# EAGLE schematic RUDAS_KID_designBox (EAGLE 9.3.0)

## Sheet 1 of 2
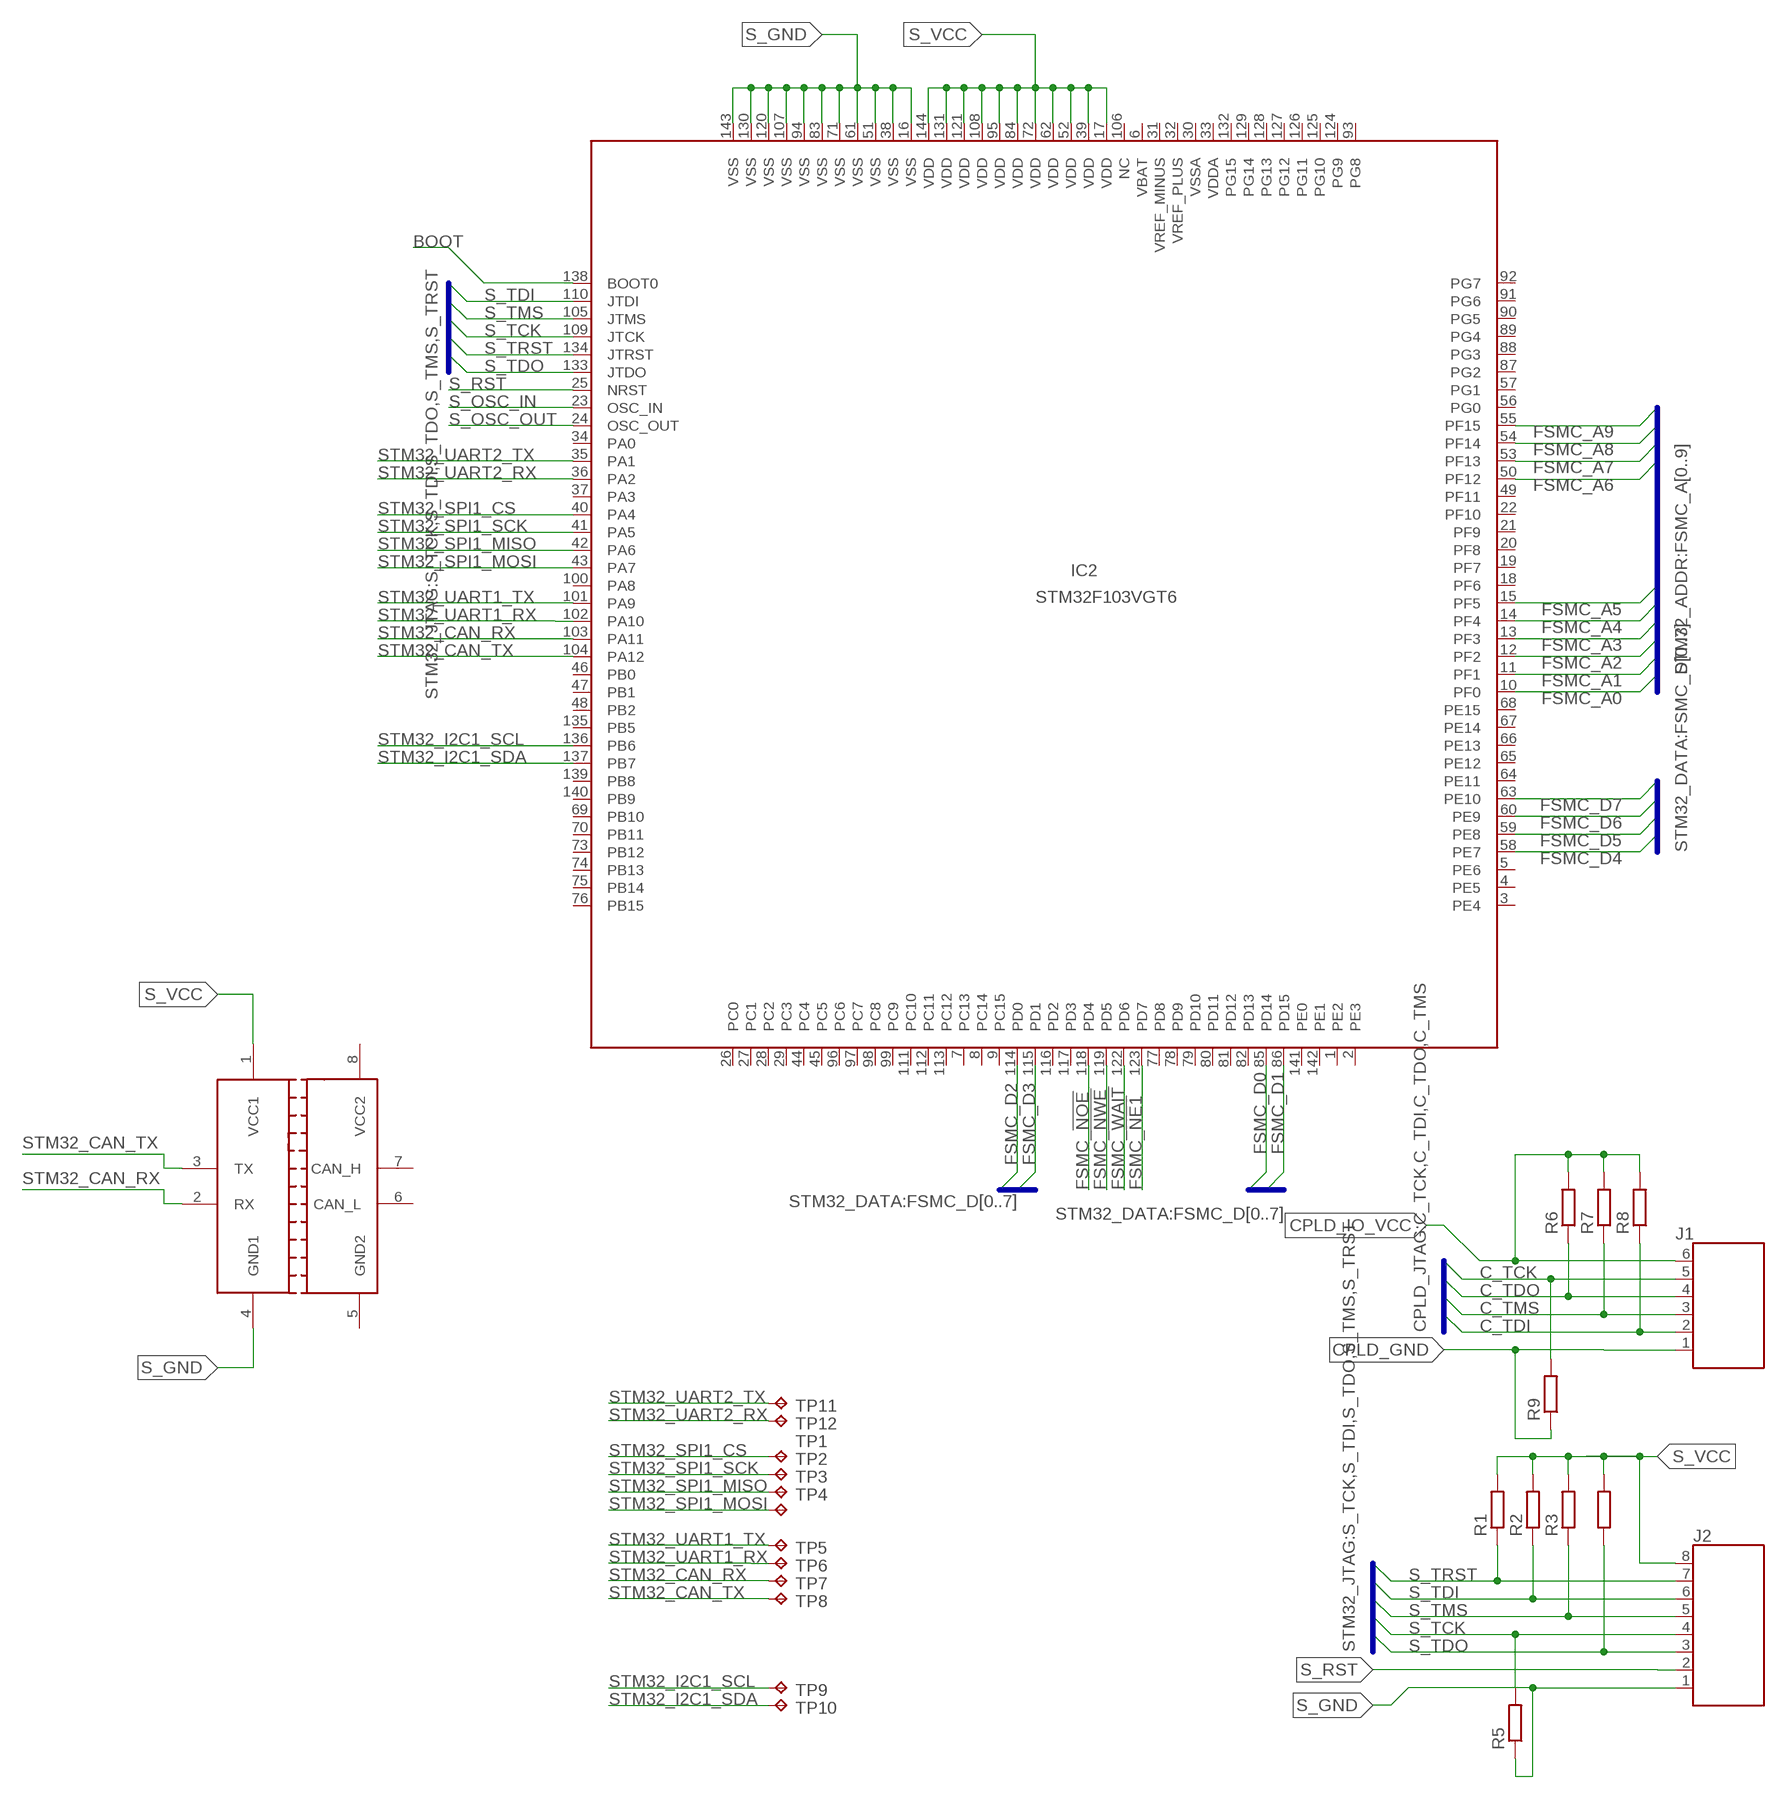
[diagram p0: schematic, sheet 1, part 1 of 2]
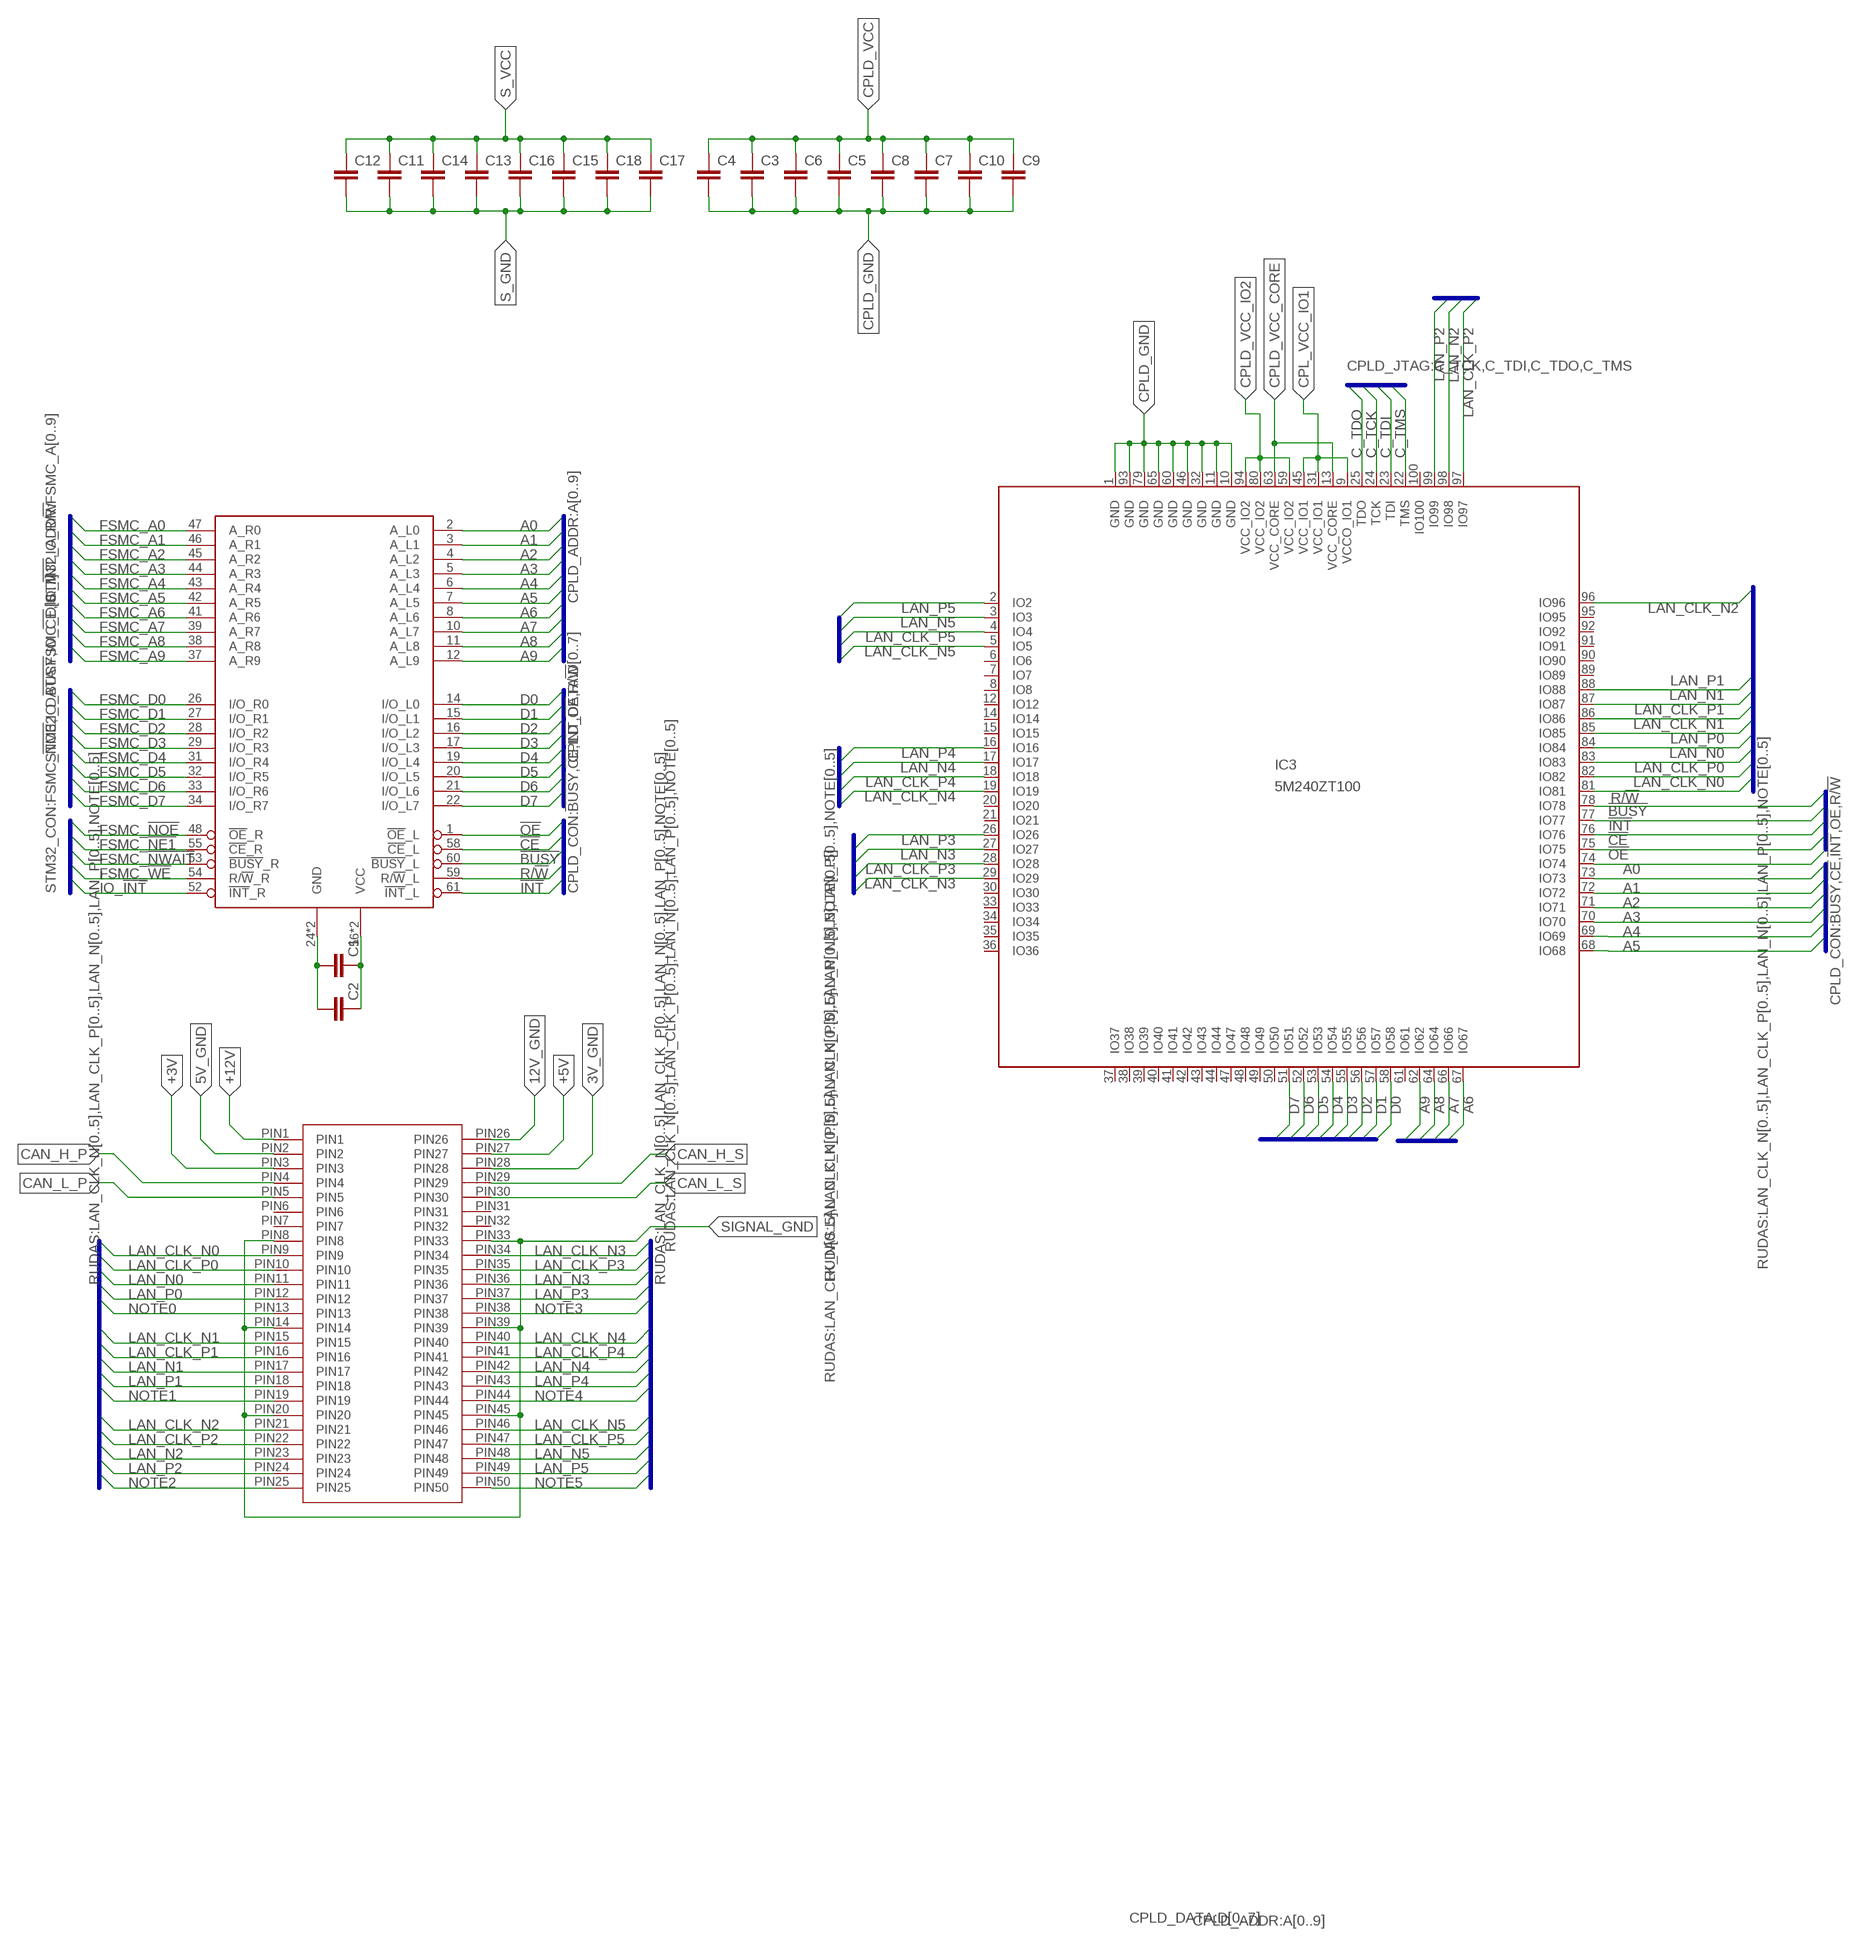
[diagram p1: schematic, sheet 1, part 2 of 2]

### Parts
C1  C-EUC2012  [C2012]
C2  C-EUC2012  [C2012]
C3  C-EUC2012  [C2012]
C4  C-EUC2012  [C2012]
C5  C-EUC2012  [C2012]
C6  C-EUC2012  [C2012]
C7  C-EUC2012  [C2012]
C8  C-EUC2012  [C2012]
C9  C-EUC2012  [C2012]
C10  C-EUC2012  [C2012]
C11  C-EUC2012  [C2012]
C12  C-EUC2012  [C2012]
C13  C-EUC2012  [C2012]
C14  C-EUC2012  [C2012]
C15  C-EUC2012  [C2012]
C16  C-EUC2012  [C2012]
C17  C-EUC2012  [C2012]
C18  C-EUC2012  [C2012]
IC2  STM32F103VGT6  STM32F1_XL_DENSITY_LQFP144  [LQFP144]
IC3  5M240ZT100  [TQFP100]
J1  686106183522  [686106183522]
J2  686108183422  [686108183422]
R1  R-EU_R2012  [R2012]
R2  R-EU_R2012  [R2012]
R3  R-EU_R2012  [R2012]
R4  R-EU_R2012  [R2012]
R5  R-EU_R2012  [R2012]
R6  R-EU_R2012  [R2012]
R7  R-EU_R2012  [R2012]
R8  R-EU_R2012  [R2012]
R9  R-EU_R2012  [R2012]
TP1  TP063  [TP_063]
TP2  TP063  [TP_063]
TP3  TP063  [TP_063]
TP4  TP063  [TP_063]
TP5  TP063  [TP_063]
TP6  TP063  [TP_063]
TP7  TP063  [TP_063]
TP8  TP063  [TP_063]
TP9  TP063  [TP_063]
TP10  TP063  [TP_063]
TP11  TP063  [TP_063]
TP12  TP063  [TP_063]
U$1  IDT71V30  [TQFP64]
U$2  ISO1050  [SOP8]
U$5  CARD_EDGE_50PINM80-5305042  [M80-5305042]

### Nets
3V_GND: U$5.PIN28
5V_GND: U$5.PIN2
12V_GND: U$5.PIN26
!BUSY!: IC3.77(IO77) U$1.60(!BUSY!_L)
!CE!: IC3.75(IO75) U$1.58(!CE!_L)
!INT!: IC3.76(IO76) U$1.61(!INT!_L)
!OE!: IC3.74(IO74) U$1.1(!OE!_L)
+3V: U$5.PIN3
+5V: U$5.PIN27
+12V: U$5.PIN1
A0: IC3.73(IO73) U$1.2(A_L0)
A1: IC3.72(IO72) U$1.3(A_L1)
A2: IC3.71(IO71) U$1.4(A_L2)
A3: IC3.70(IO70) U$1.5(A_L3)
A4: IC3.69(IO69) U$1.6(A_L4)
A5: IC3.68(IO68) U$1.7(A_L5)
A6: IC3.67(IO67) U$1.8(A_L6)
A7: IC3.66(IO66) U$1.10(A_L7)
A8: IC3.64(IO64) U$1.11(A_L8)
A9: IC3.62(IO62) U$1.12(A_L9)
BOOT: IC2.138(BOOT0)
C_TCK: IC3.24(TCK) J1.5 R9.2
C_TDI: IC3.23(TDI) J1.2 R8.1
C_TDO: IC3.25(TDO) J1.4 R6.1
C_TMS: IC3.22(TMS) J1.3 R7.1
CAN_H_P: U$5.PIN4
CAN_H_S: U$5.PIN29
CAN_L_P: U$5.PIN5
CAN_L_S: U$5.PIN30
CPL_VCC_IO1: IC3.9(VCCO_IO1) IC3.31(VCC_IO1) IC3.45(VCC_IO1)
CPLD_GND: C3.2 C4.2 C5.2 C6.2 C7.2 C8.2 C9.2 C10.2 IC3.1(GND) IC3.10(GND) IC3.11(GND) IC3.32(GND) IC3.46(GND) IC3.60(GND) IC3.65(GND) IC3.79(GND) IC3.93(GND) J1.1 R9.1
CPLD_IO_VCC: J1.6 R6.2 R7.2 R8.2
CPLD_VCC: C3.1 C4.1 C5.1 C6.1 C7.1 C8.1 C9.1 C10.1
CPLD_VCC_CORE: IC3.13(VCC_CORE) IC3.63(VCC_CORE)
CPLD_VCC_IO2: IC3.59(VCC_IO2) IC3.80(VCC_IO2) IC3.94(VCC_IO2)
D0: IC3.58(IO58) U$1.14(I/O_L0)
D1: IC3.57(IO57) U$1.15(I/O_L1)
D2: IC3.56(IO56) U$1.16(I/O_L2)
D3: IC3.55(IO55) U$1.17(I/O_L3)
D4: IC3.54(IO54) U$1.19(I/O_L4)
D5: IC3.53(IO53) U$1.20(I/O_L5)
D6: IC3.52(IO52) U$1.21(I/O_L6)
D7: IC3.51(IO51) U$1.22(I/O_L7)
FSMC_!NE1!: IC2.123(PD7) U$1.55(!CE!_R)
FSMC_!NOE!: IC2.118(PD4) U$1.48(!OE!_R)
FSMC_!NWAIT!: U$1.53(!BUSY!_R)
FSMC_!NWE!: IC2.119(PD5)
FSMC_!WAIT!: IC2.122(PD6)
FSMC_!WE!: U$1.54(R/!W!_R)
FSMC_A0: IC2.10(PF0) U$1.47(A_R0)
FSMC_A1: IC2.11(PF1) U$1.46(A_R1)
FSMC_A2: IC2.12(PF2) U$1.45(A_R2)
FSMC_A3: IC2.13(PF3) U$1.44(A_R3)
FSMC_A4: IC2.14(PF4) U$1.43(A_R4)
FSMC_A5: IC2.15(PF5) U$1.42(A_R5)
FSMC_A6: IC2.50(PF12) U$1.41(A_R6)
FSMC_A7: IC2.53(PF13) U$1.39(A_R7)
FSMC_A8: IC2.54(PF14) U$1.38(A_R8)
FSMC_A9: IC2.55(PF15) U$1.37(A_R9)
FSMC_D0: IC2.85(PD14) U$1.26(I/O_R0)
FSMC_D1: IC2.86(PD15) U$1.27(I/O_R1)
FSMC_D2: IC2.114(PD0) U$1.28(I/O_R2)
FSMC_D3: IC2.115(PD1) U$1.29(I/O_R3)
FSMC_D4: IC2.58(PE7) U$1.31(I/O_R4)
FSMC_D5: IC2.59(PE8) U$1.32(I/O_R5)
FSMC_D6: IC2.60(PE9) U$1.33(I/O_R6)
FSMC_D7: IC2.63(PE10) U$1.34(I/O_R7)
IO_!INT!: U$1.52(!INT!_R)
LAN_CLK_N0: IC3.81(IO81) U$5.PIN9
LAN_CLK_N1: IC3.85(IO85) U$5.PIN15
LAN_CLK_N2: IC3.96(IO96) U$5.PIN21
LAN_CLK_N3: IC3.29(IO29) U$5.PIN34
LAN_CLK_N4: IC3.19(IO19) U$5.PIN40
LAN_CLK_N5: IC3.5(IO5) U$5.PIN46
LAN_CLK_P0: IC3.82(IO82) U$5.PIN10
LAN_CLK_P1: IC3.86(IO86) U$5.PIN16
LAN_CLK_P2: IC3.97(IO97) U$5.PIN22
LAN_CLK_P3: IC3.28(IO28) U$5.PIN35
LAN_CLK_P4: IC3.18(IO18) U$5.PIN41
LAN_CLK_P5: IC3.4(IO4) U$5.PIN47
LAN_N0: IC3.83(IO83) U$5.PIN11
LAN_N1: IC3.87(IO87) U$5.PIN17
LAN_N2: IC3.98(IO98) U$5.PIN23
LAN_N3: IC3.27(IO27) U$5.PIN36
LAN_N4: IC3.17(IO17) U$5.PIN42
LAN_N5: IC3.3(IO3) U$5.PIN48
LAN_P0: IC3.84(IO84) U$5.PIN12
LAN_P1: IC3.88(IO88) U$5.PIN18
LAN_P2: IC3.99(IO99) U$5.PIN24
LAN_P3: IC3.26(IO26) U$5.PIN37
LAN_P4: IC3.16(IO16) U$5.PIN43
LAN_P5: IC3.2(IO2) U$5.PIN49
N$1: C1.1 C2.1 U$1.56(VCC) U$1.57(VCC)
N$2: C1.2 C2.2 U$1.24(GND) U$1.25(GND)
NOTE0: U$5.PIN13
NOTE1: U$5.PIN19
NOTE2: U$5.PIN25
NOTE3: U$5.PIN38
NOTE4: U$5.PIN44
NOTE5: U$5.PIN50
R/!W!: IC3.78(IO78) U$1.59(R/!W!_L)
S_GND: C11.2 C12.2 C13.2 C14.2 C15.2 C16.2 C17.2 C18.2 IC2.16(VSS) IC2.38(VSS) IC2.51(VSS) IC2.61(VSS) IC2.71(VSS) IC2.83(VSS) IC2.94(VSS) IC2.107(VSS) IC2.120(VSS) IC2.130(VSS) IC2.143(VSS) J2.1 R5.1 U$2.4(GND1)
S_OSC_IN: IC2.23(OSC_IN)
S_OSC_OUT: IC2.24(OSC_OUT)
S_RST: IC2.25(NRST) J2.2
S_TCK: IC2.109(JTCK) J2.4 R5.2
S_TDI: IC2.110(JTDI) J2.6 R2.1
S_TDO: IC2.133(JTDO) J2.3 R4.1
S_TMS: IC2.105(JTMS) J2.5 R3.1
S_TRST: IC2.134(JTRST) J2.7 R1.1
S_VCC: C11.1 C12.1 C13.1 C14.1 C15.1 C16.1 C17.1 C18.1 IC2.17(VDD) IC2.39(VDD) IC2.52(VDD) IC2.62(VDD) IC2.72(VDD) IC2.84(VDD) IC2.95(VDD) IC2.108(VDD) IC2.121(VDD) IC2.131(VDD) IC2.144(VDD) J2.8 R1.2 R2.2 R3.2 R4.2 U$2.1(VCC1)
SIGNAL_GND: U$5.PIN8 U$5.PIN14 U$5.PIN20 U$5.PIN33 U$5.PIN39 U$5.PIN45
STM32_CAN_RX: IC2.103(PA11) TP7.TP U$2.2(RX)
STM32_CAN_TX: IC2.104(PA12) TP8.TP U$2.3(TX)
STM32_I2C1_SCL: IC2.136(PB6) TP9.TP
STM32_I2C1_SDA: IC2.137(PB7) TP10.TP
STM32_SPI1_CS: IC2.40(PA4) TP1.TP
STM32_SPI1_MISO: IC2.42(PA6) TP3.TP
STM32_SPI1_MOSI: IC2.43(PA7) TP4.TP
STM32_SPI1_SCK: IC2.41(PA5) TP2.TP
STM32_UART1_RX: IC2.102(PA10) TP6.TP
STM32_UART1_TX: IC2.101(PA9) TP5.TP
STM32_UART2_RX: IC2.36(PA2) TP12.TP
STM32_UART2_TX: IC2.35(PA1) TP11.TP
Unconnected: IC2.1(PE2) IC2.2(PE3) IC2.3(PE4) IC2.4(PE5) IC2.5(PE6) IC2.6(VBAT) IC2.7(PC13) IC2.8(PC14) IC2.9(PC15) IC2.18(PF6) IC2.19(PF7) IC2.20(PF8) IC2.21(PF9) IC2.22(PF10) IC2.26(PC0) IC2.27(PC1) IC2.28(PC2) IC2.29(PC3) IC2.31(VREF_MINUS) IC2.32(VREF_PLUS) IC2.34(PA0) IC2.37(PA3) IC2.44(PC4) IC2.45(PC5) IC2.46(PB0) IC2.47(PB1) IC2.48(PB2) IC2.49(PF11) IC2.56(PG0) IC2.57(PG1) IC2.64(PE11) IC2.65(PE12) IC2.66(PE13) IC2.67(PE14) IC2.68(PE15) IC2.69(PB10) IC2.70(PB11) IC2.73(PB12) IC2.74(PB13) IC2.75(PB14) IC2.76(PB15) IC2.77(PD8) IC2.78(PD9) IC2.79(PD10) IC2.80(PD11) IC2.81(PD12) IC2.82(PD13) IC2.87(PG2) IC2.88(PG3) IC2.89(PG4) IC2.90(PG5) IC2.91(PG6) IC2.92(PG7) IC2.93(PG8) IC2.96(PC6) IC2.97(PC7) IC2.98(PC8) IC2.99(PC9) IC2.100(PA8) IC2.106(NC) IC2.111(PC10) IC2.112(PC11) IC2.113(PC12) IC2.116(PD2) IC2.117(PD3) IC2.124(PG9) IC2.125(PG10) IC2.126(PG11) IC2.127(PG12) IC2.128(PG13) IC2.129(PG14) IC2.132(PG15) IC2.135(PB5) IC2.139(PB8) IC2.140(PB9) IC2.141(PE0) IC2.142(PE1) IC3.6(IO6) IC3.7(IO7) IC3.8(IO8) IC3.12(IO12) IC3.14(IO14) IC3.15(IO15) IC3.20(IO20) IC3.21(IO21) IC3.30(IO30) IC3.33(IO33) IC3.34(IO34) IC3.35(IO35) IC3.36(IO36) IC3.37(IO37) IC3.38(IO38) IC3.39(IO39) IC3.40(IO40) IC3.41(IO41) IC3.42(IO42) IC3.43(IO43) IC3.44(IO44) IC3.47(IO47) IC3.48(IO48) IC3.49(IO49) IC3.50(IO50) IC3.61(IO61) IC3.89(IO89) IC3.90(IO90) IC3.91(IO91) IC3.92(IO92) IC3.95(IO95) IC3.100(IO100) U$5.PIN6 U$5.PIN7 U$5.PIN31 U$5.PIN32

### Buses
CPLD_DATA:D[0..7]
CPLD_ADDR:A[0..9]
CPLD_CON:!BUSY!,!CE!,!INT!,!OE!,R/!W!
STM32_ADDR:FSMC_A[0..9]
STM32_DATA:FSMC_D[0..7]
STM32_CON:FSMC_!NOE!,IO_!BUSY!,IO_!CE!,IO_!INT!,IO_R/!W!
STM32_JTAG:S_TCK,S_TDI,S_TDO,S_TMS,S_TRST
CPLD_JTAG:C_TCK,C_TDI,C_TDO,C_TMS
RUDAS:LAN_CLK_N[0..5],LAN_CLK_P[0..5],LAN_N[0..5],LAN_P[0..5],NOTE[0..5]

## Sheet 2 of 2

## Power pins joined to a net without a drawn wire
CAN_H: U$2.7(CAN_H)
CAN_L: U$2.6(CAN_L)
GND2: U$2.5(GND2)
VCC2: U$2.8(VCC2)
VDDA: IC2.33(VDDA)
VSSA: IC2.30(VSSA)

## Library data of the parts
C1-C18 = rcl:C-EU: CAPACITOR, European symbol; SPICEPREFIX: C
IC2 = ORBIT-STM32F:STM32F1_XL_DENSITY_LQFP144: STM32F1_XL_density_LQFP144 edit this description Auto generated by make-symbol-device-package-bsdl.ulp Rev. 44 Source: STM32F1_XL_density_LQFP144.bsd
IC3 = ORBiT-IC-CPLD-Intel-MAX_V:5M240ZT100: 5M240ZT100 Auto generated by make-symbol-device-package-bsdl.ulp Rev. 44 This devide should suitable for any MAX V 5M240ZT100*** Source: 5M240ZT100.bsd https://www.intel.com/content/dam/altera-www/global/en_US/others/support/devices/bsdl/5M240ZT100.bsd
J1 = Wurth_Elektronik_Electromechanic_FPC_Connectors_&_Flat_Flexible_Cable_rev18c:686106183522: 686106183522 WR-FPC 1.00mm SMT Horizontal Bottom Contact - Low Profile <http://katalog.we-online.de/media/images/v2/Family_WR-FPC_6861xx183522.jpg> Details see: http://katalog.we-online.de/en/em/FPC_1_00_SMT_ZIF_HORIZONTAL_BOTTOM_CONTACT_LOW_PROFILE_6861xx183522 Created by Yingchun,shan 2016 (C) Wurth Elektronik
J2 = Wurth_Elektronik_Electromechanic_FPC_Connectors_&_Flat_Flexible_Cable_rev18c:686108183422: 686108183422 WR-FPC 1.00mm SMT Horizontal Top Contact - Low Profile <http://katalog.we-online.de/media/images/v2/Family_WR-FPC_6861xx183422.jpg> Details see: http://katalog.we-online.de/en/em/FPC_1_00_SMT_ZIF_HORIZONTAL_TOP_CONTACT_LOW_PROFILE_6861xx183422 Created by Yingchun,shan 2016 (C) Wurth Elektronik
R1-R9 = rcl:R-EU_: RESISTOR, European symbol; SPICEPREFIX: R
TP1-TP12 = ORBiT-special:TP: Test Point, 0.063" Through-Hole
U$1 = ORBiT-IC-IDT-sram:IDT71V30
U$2 = ORBiT-IC-CAN-DRIVER:ISO1050
U$5 = ORBIT-CON-HARWIN-101LOK:CARD_EDGE_50PIN: ORBIT-CON-HARWIN-101LOK-M80-4115042 Description: Headers & Wire Housings 25+25 POS FEM WO J/S 4.5mm TAIL TIN Website: https://www.mouser.com/ProductDetail/Harwin/M80-4115042?qs=sGAEpiMZZMs%252BGHln7q6pmzlZUuX%2F53qjVusOkRqubuw%3D